# EAGLE design NanoLiteUSB (EAGLE 6.3)
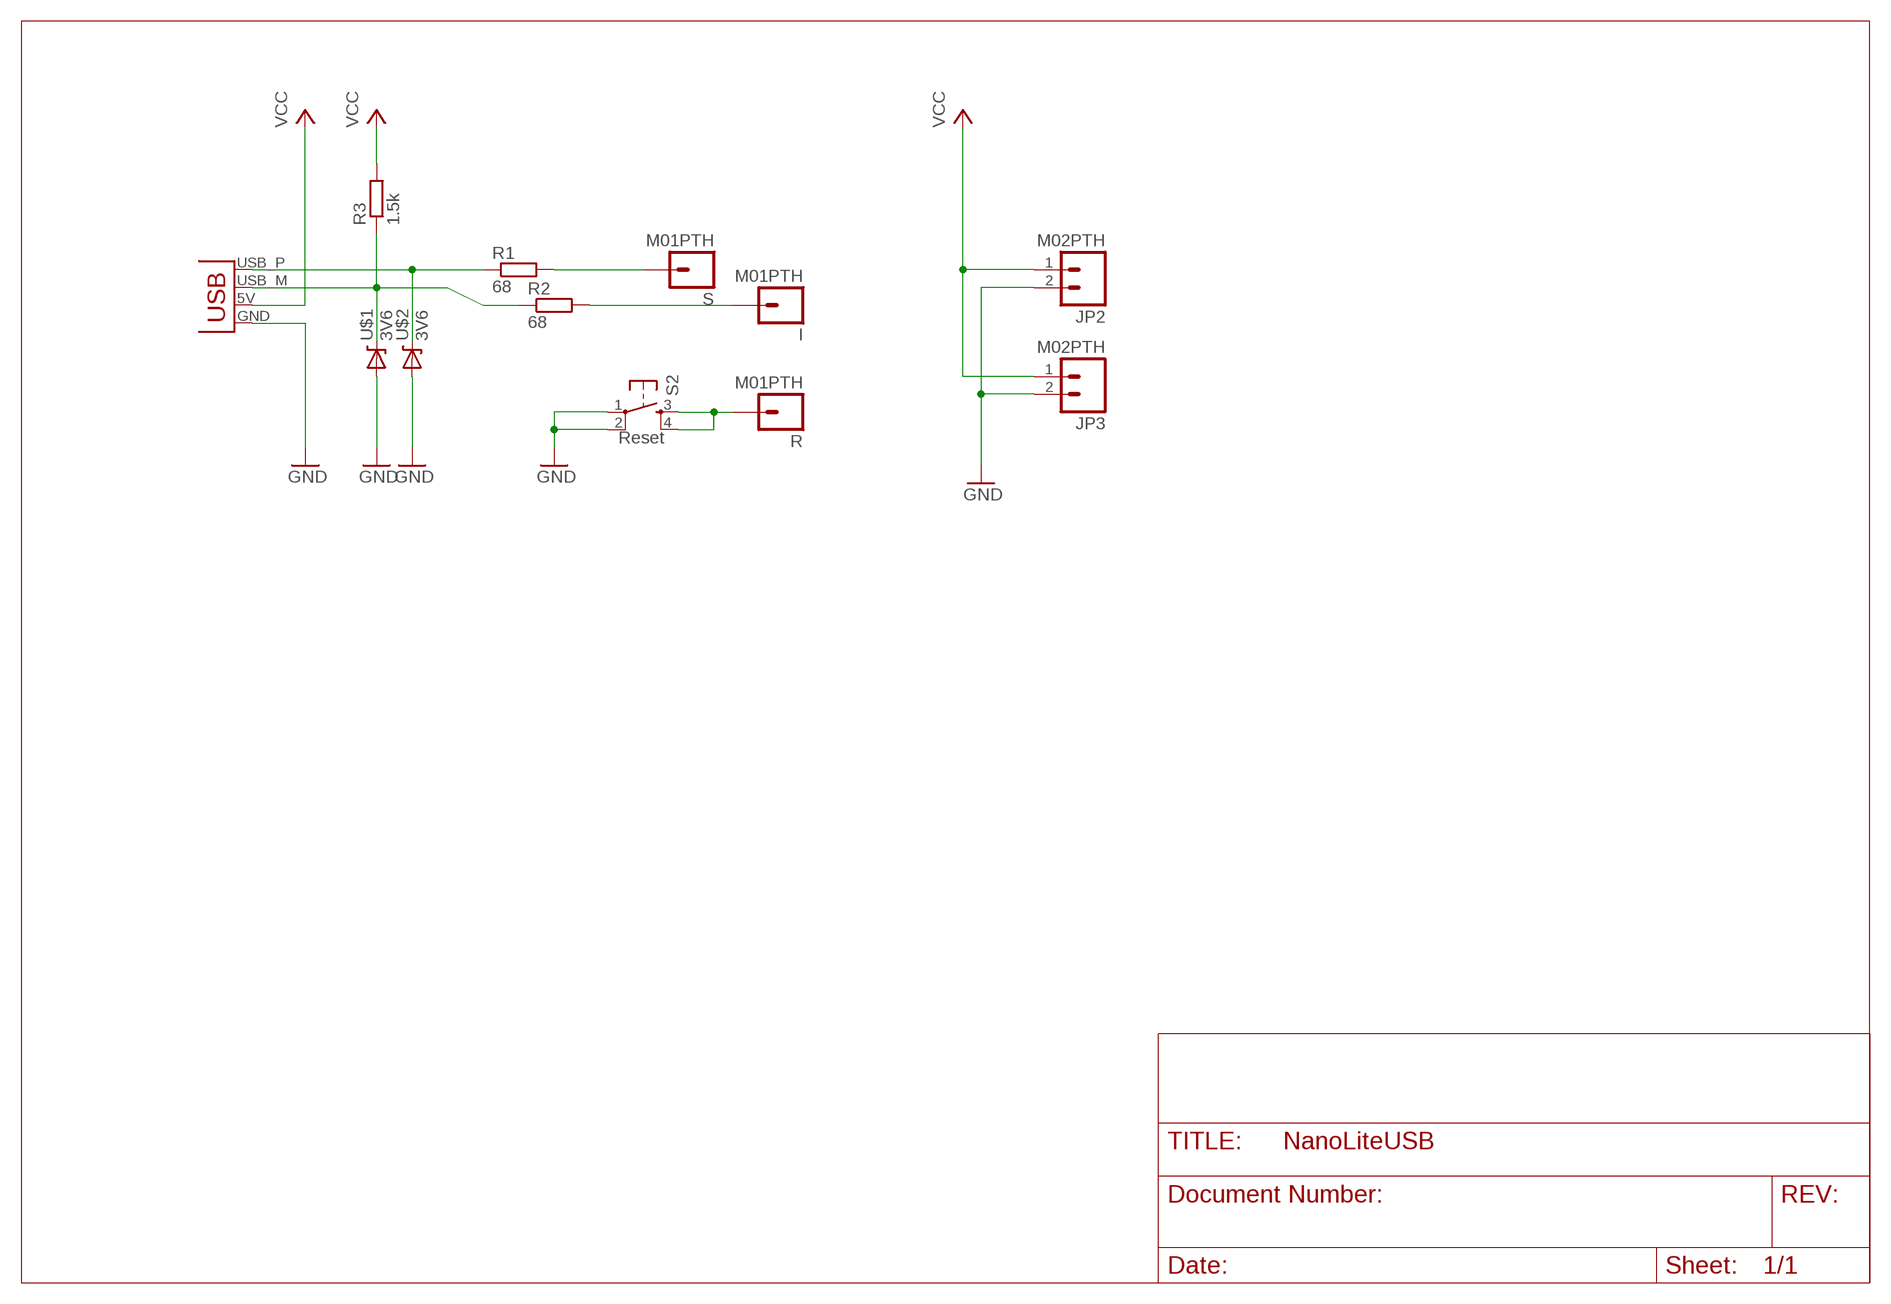
[diagram p0: schematic, sheet 1]

## Parts
I  M01PTH  [1X01]
JP1  USBPCB  [USB-A-PCB]
JP2  M02PTH  [1X02]
JP3  M02PTH  [1X02]
R  M01PTH  [1X01]
R1  68  R-EU_R0603  [R0603]
R2  68  R-EU_R0603  [R0603]
R3  1.5k  R-EU_R0603  [R0603]
S  M01PTH  [1X01]
S2  Reset  TAC_SWITCHSMD  [TACTILE_SWITCH_SMD]
U$1  3V6  DIODE-ZENER-BZT52  [SOD-323]
U$2  3V6  DIODE-ZENER-BZT52  [SOD-323]

## Nets
GND: JP1.GND JP2.2 JP3.2 S2.1 S2.2 U$1.2(A) U$2.2(A)
N$1: R.1 S2.3 S2.4
N$3: JP1.USB_P(D+) R1.1 U$2.1(C)
N$4: JP1.USB_M(D-) R2.1 R3.1 U$1.1(C)
N$5: R1.2 S.1
N$6: I.1 R2.2
VCC: JP1.5V(VBUS) JP2.1 JP3.1 R3.2

## Library data of the parts
I R S = SparkFun-Connectors:M01: Header 1 Standard 1-pin 0.1" header. Use with straight break away headers (SKU : PRT-00116), right angle break away headers (PRT-00553), swiss pins (PRT-00743), machine pins (PRT-00117), and female headers (PRT-00115).
JP1 = SparkFun-Connectors:USB: USB Connectors USB-B-PTH is fully proven SKU : PRT-00139/CONN-08278 USB-miniB is fully proven SKU : PRT-00587 USB-A-PCB is untested. USB-A-H is throughly reviewed, but untested. Spark Fun Electronics SKU : PRT-00437 USB-B-SMT is throughly reviewed, but untested. Needs silkscreen touching up. USB-A-S has not been used/tested USB-MB-H has not been used/tested USB-MICROB has been used. CONN-09505
JP2 JP3 = SparkFun-Connectors:M02: Standard 2-pin 0.1" header. Use with - straight break away headers ( PRT-00116) - right angle break away headers (PRT-00553) - swiss pins (PRT-00743) - machine pins (PRT-00117) - female headers (PRT-00115) Molex polarized connector foot print use with: PRT-08233 with associated crimp pins and housings. 2.54_SCREWTERM for use with PRT-10571. 3.5mm Screw Terminal footprints for PRT-08084 5mm Screw Terminal footprints for use with PRT-08433
R1-R3 = resistor:R-EU_: RESISTOR, European symbol
S2 = SparkFun:TAC_SWITCH: Momentary Switch Button commonly used for reset or general input. Spark Fun Electronics SKU : COM-00097
U$1 U$2 = SparkFun-DiscreteSemi:DIODE-ZENER: Zener Diode Production Part - 8199 3.4V Zener Voltage

## Net classes
1 vcc: width 0.254 mm

## Board
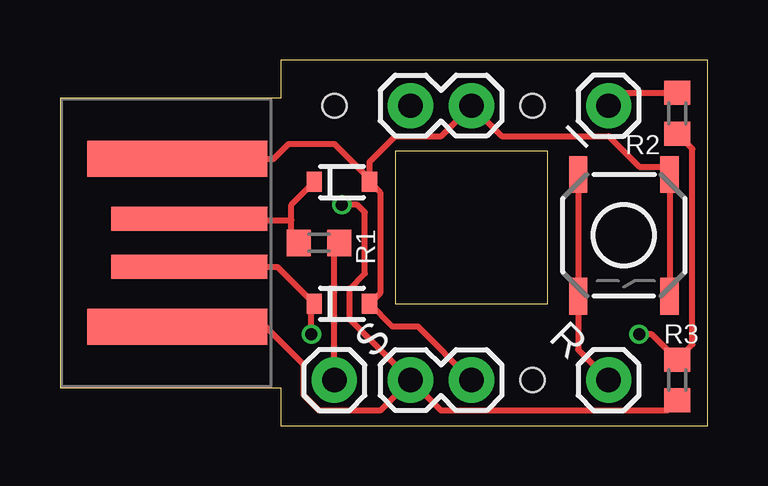
[diagram p1: board, top side]
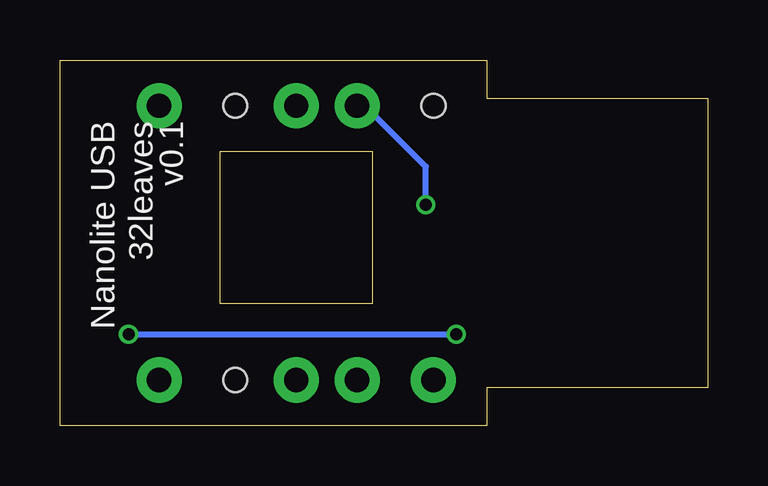
[diagram p2: board, bottom side, seen from below]

Size 26.99 x 15.24 mm. Coordinates in mm from the lower left corner, seen from the top.
Outline: 0,1.59 9.21,1.59 9.21,0 26.99,0 26.99,15.24 9.21,15.24 9.21,13.65 0,13.65 0,1.59
Outline: 13.97,11.43 13.97,5.08 20.32,5.08 20.32,11.43 13.97,11.43
Copper layers (1*16): Top 0.035mm / dielectric 1.5mm / Bottom 0.035mm
Design rules "Fusion_eagle_rule_v1.1": minimum track width 6mil, minimum drill 12mil, track to track 6mil, track to pad 6mil, pad to pad 6mil, via to via 6mil, smd to smd 0mil, copper to edge 10mil, drill to drill 10mil, minimum pad ring 10mil, minimum via ring 6mil, stop-mask expansion 2mil, vias tented up to drill 100mil, thermal gap 10mil
Holes 1 mm at 11.43,13.34 19.68,13.34 19.68,1.91

### Footprints (pad centres in the part's own frame; a part is rotated, then mirrored left to right if it is on the bottom)
1X01 = drill 1.016 pad 1.88: 1 0,0
USB-A-PCB = smd 7.5 x 1.5: 5V -0.2,-3.5; GND -0.2,3.5 | smd 6.5 x 1: USB_M 0.3,-1; USB_P 0.3,1
1X02 = drill 1.016 pad 1.88: 1 0,0; 2 2.54,0
R0603 = smd 1 x 1.1: 1 -0.85,0; 2 0.85,0
TACTILE_SWITCH_SMD = smd 1.524 x 0.762: 1 -2.54,1.905; 2 2.54,1.905; 3 -2.54,-1.905; 4 2.54,-1.905
SOD-323 = smd 0.63 x 0.83: 1 -1.15,0; 2 1.15,0

### Placement (x,y rotation side)
I  22.86,13.34 90 top
JP1  5.08,7.62 0 top
JP2  14.61,13.34 0 top
JP3  14.61,1.91 0 top
R  22.86,1.91 0 top
R1  10.79,7.62 0 top
R2  25.72,13.02 90 top
R3  25.72,1.91 270 top
S  11.43,1.91 0 top
S2  23.5,7.94 270 top
U$1  11.75,5.08 0 top
U$2  11.75,10.16 0 top

### Tracks (layer width: path | path; a pad name or v marks a point on that pad's centre or on a via)
GND
  Top 0.254: S2.2 S2.1 25.08,10.79 24.13,10.79 22.86,12.06 18.41,12.06 JP2.2 15.88,12.06 13.97,12.06 12.9,10.99 U$2.2 | JP1.GND 8.9,11.12 9.53,11.75 11.43,11.75 12.9,10.28 U$2.2 | JP3.2 14.92,4.13 13.85,4.13 U$1.2 13.34,5.52 13.34,9.72 U$2.2
N$1
  Top 0.254: S2.3 S2.4 21.59,3.17 R.1
N$3
  Top 0.254: JP1.USB_P 8.11,8.62 8.15,8.57 9.64,8.57 | R1.1 9.64,7.92 9.64,8.57 | 9.64,8.57 9.64,9.21 U$2.1
N$4  (via drill 0.5 pad 0.25)
  Top 0.254: JP1.USB_M 9.06,6.62 U$1.1 | R2.1 26.35,11.53 26.35,3.39 R3.1 24.66,3.81 v24.13,3.81 | v10.48,3.81 10.48,4.96 U$1.1 | U$1.1 10.48,5.08
  Bottom 0.254: v24.13,3.81 v10.48,3.81
N$5
  Top 0.254: S.1 11.43,7.41 R1.2
N$6
  Top 0.254: I.1 23.39,13.87 R2.2
VCC  (via drill 0.5 pad 0.25)
  Top 0.254: R3.2 25.3,0.64 15.88,0.64 JP3.1 | 5.19,3.81 JP1.5V 8.57,4.13 10.16,2.54 10.16,1.27 10.79,0.64 13.34,0.64 JP3.1 | JP3.1 12.06,4.45 12.06,5.71 12.7,6.35 12.7,8.89 12.38,9.21 v11.75,9.21
  Bottom 0.254: v11.75,9.21 11.75,10.79 14.29,13.34 JP2.1

### Text on the board
bNames: v0.1 | 32leaves | Nanolite USB